# Altium schematic sheet Power Supply.SchDoc
size A; SheetNumber: 1; SheetTotal: 1
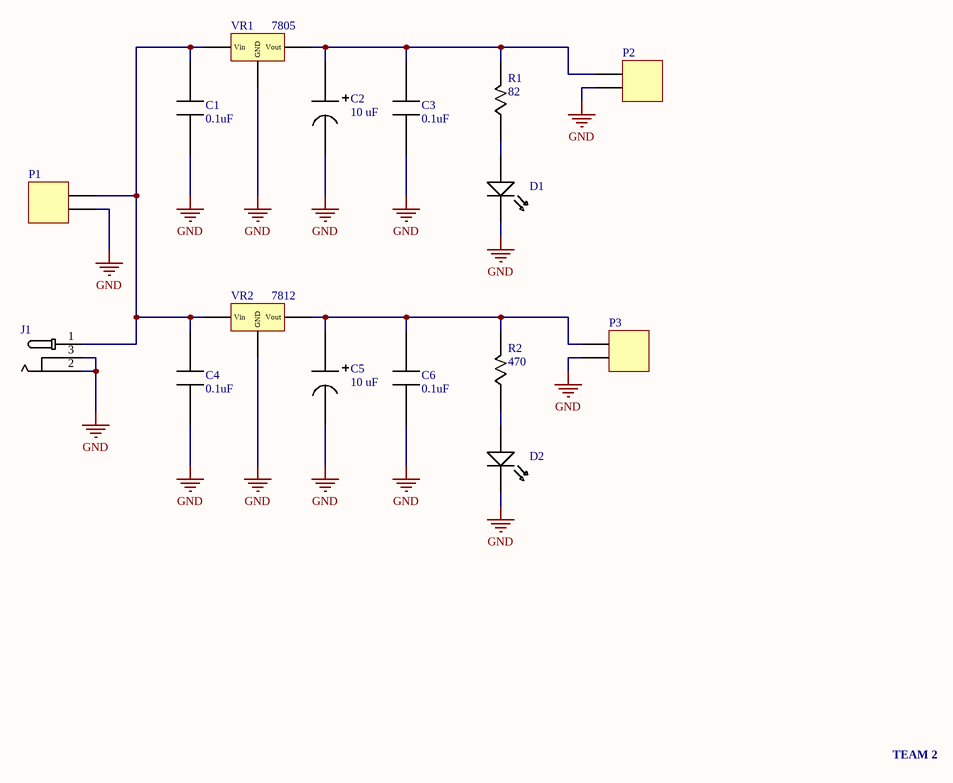
[diagram p0: Power Supply.SchDoc]

## Parts
C1  0.1uF  [CAPACITOR]
C2  10 uF  [POL CAP]
C3  0.1uF  [CAPACITOR]
C4  0.1uF  [CAPACITOR]
C5  10 uF  [POL CAP]
C6  0.1uF  [CAPACITOR]
D1  LED  [LED]  (value not drawn)
D2  LED  [LED]  (value not drawn)
J1  POWER JACK SOCKET  [POWER JACK SOCKET]  (value not drawn)
P1  TERMINAL BLOCK  [TERMINAL BLOCK]  (value not drawn)
P2  TERMINAL BLOCK  [TERMINAL BLOCK]  (value not drawn)
P3  TERMINAL BLOCK  [TERMINAL BLOCK]  (value not drawn)
R1  82  [RESISTOR]
R2  470  [RESISTOR]
VR1  7805  [REGULATOR7805]
VR2  7812  [REGULATOR7812]

## Nets
GND: C1.2 C2.2 C3.2 C4.2 C5.2 C6.2 D1.2 D2.2 J1.2 J1.3 P1.2 P2.1 P3.1 VR1.3(GND) VR2.3(GND)
NetC1_1: C1.1 C4.1 J1.1 P1.1 VR1.1(Vin) VR2.1(Vin)
NetC2_1: C2.1 C3.1 P2.2 R1.2 VR1.2(Vout)
NetC5_1: C5.1 C6.1 P3.2 R2.2 VR2.2(Vout)
NetD1_1: D1.1 R1.1
NetD2_1: D2.1 R2.1

## Notes on the sheet
- TEAM 2

## Library data of the parts
C1 C3 C4 C6 = CAPACITOR: Manufacture: AVX; Manufacture Part Number: AR205F104K4R
C2 C5 = POL CAP: Manufacture: Panasonic; Manufacture Part Number: EEUEB1J100SB
D1 D2 = LED: Manufacture: Wurth Electronics; manufacture Part Number: 151033GS03000
J1 = POWER JACK SOCKET: Manufacture: MPD (Memory Protection Devices); Manufacture Part Number: EJ508A
R1 R2 = RESISTOR
VR1 = 7805: Manufacture: STMicroelectronics; Manufacture Part Number: 7805CV
VR2 = 7812: Manufacture: STMicroelectronics; Manufacture Part Number: L7812CV